# Altium schematic sheet [01] MCU.SchDoc: Raspberry Pi RP2040 MCU
size B; Engineer: M. Folejewski; DocumentNumber: 1; SheetNumber: 1; SheetTotal: 2; PageSize: B; Designators: 1-99
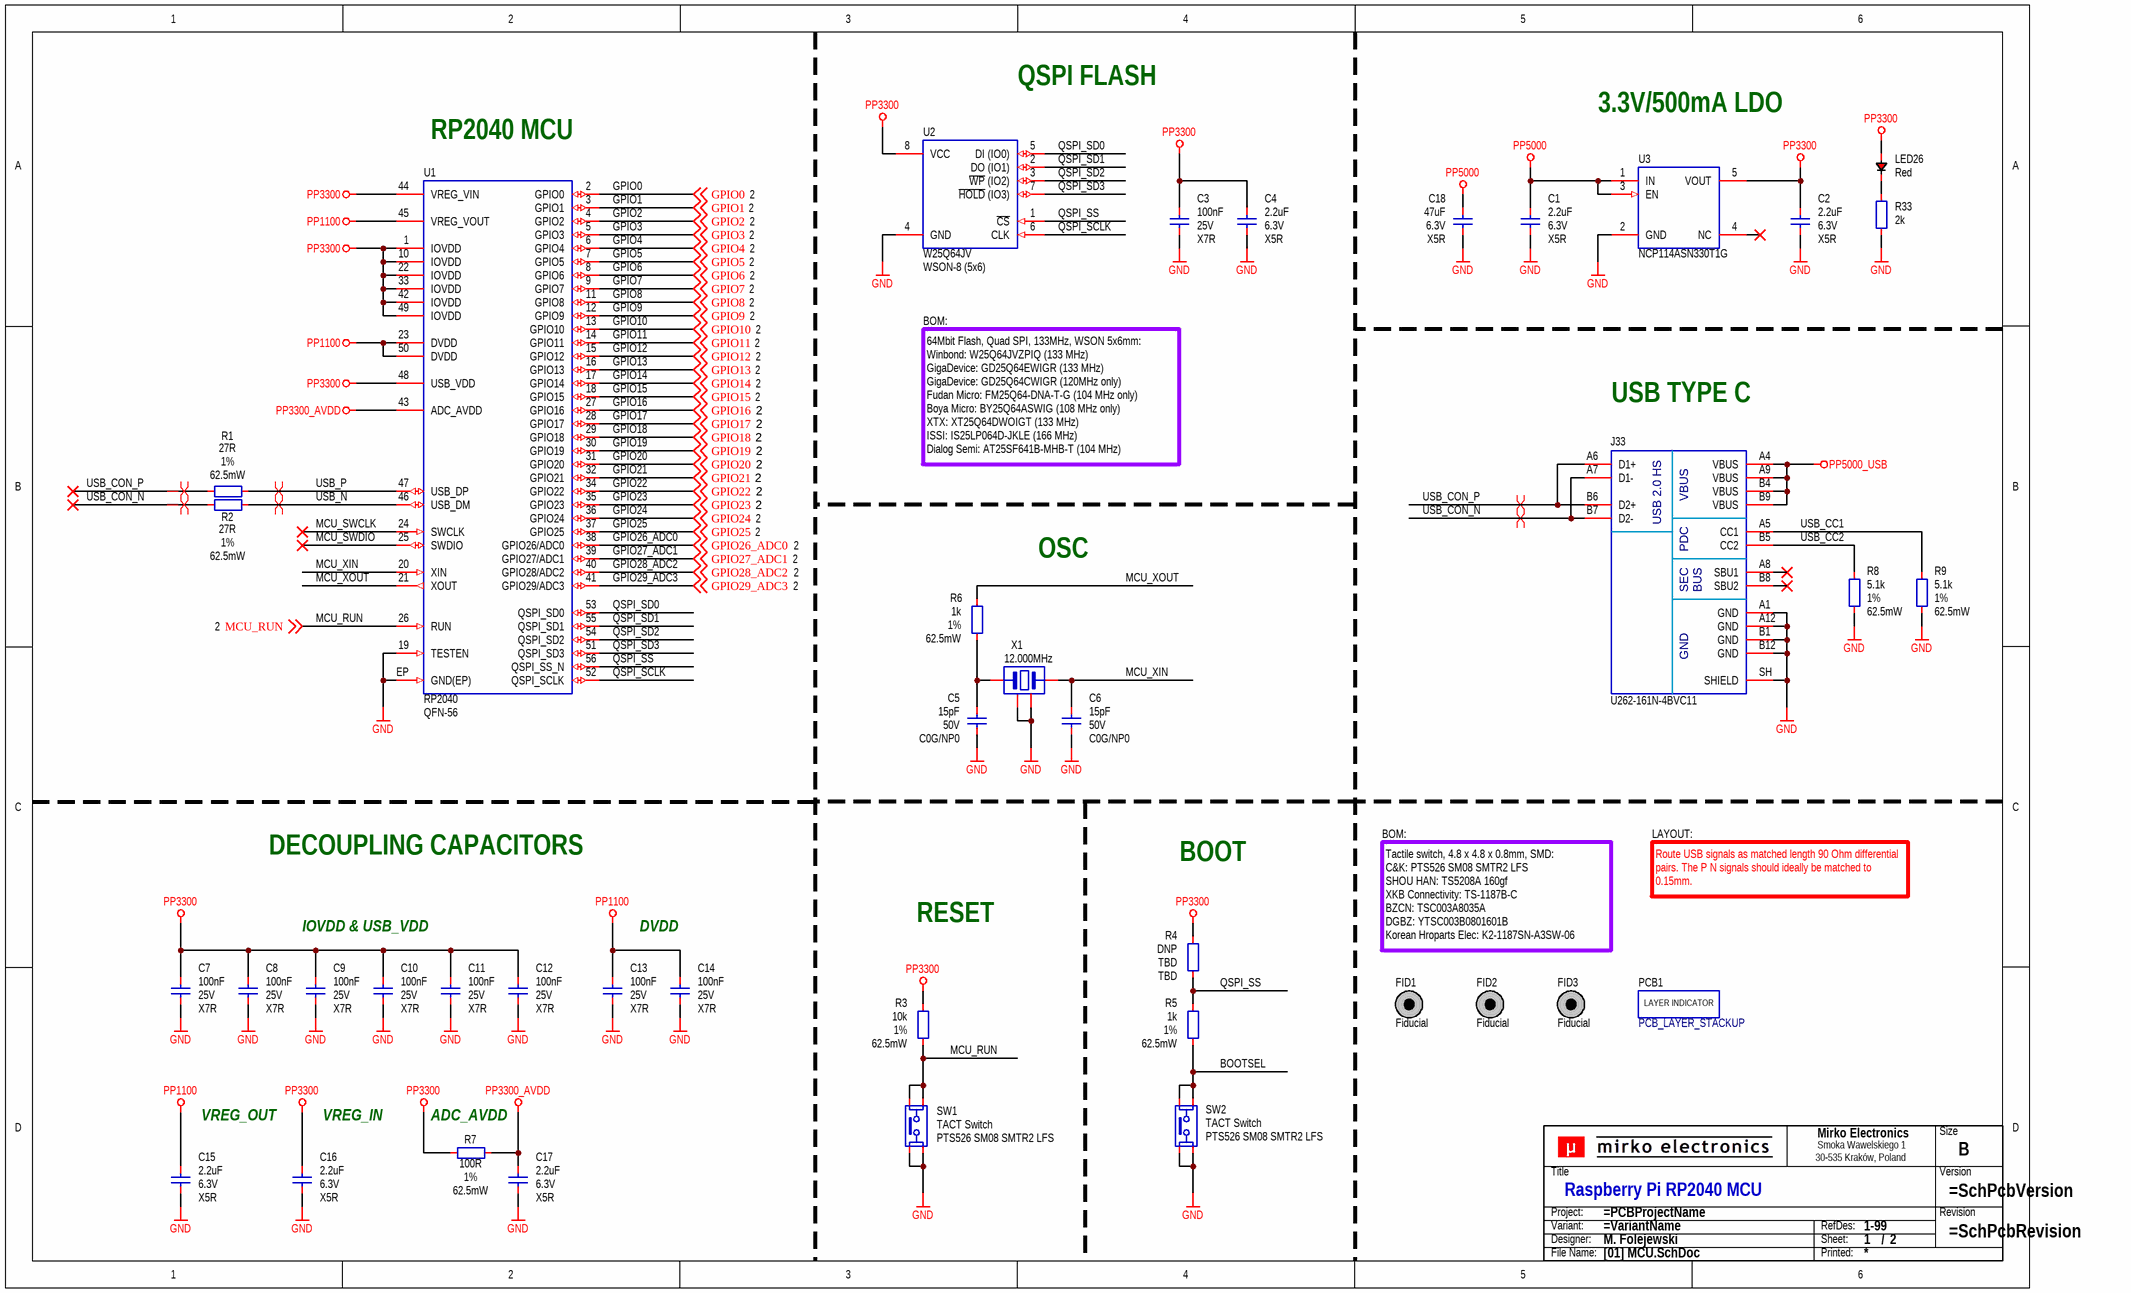
[diagram p0: [01] MCU.SchDoc]

## Parts
C1  2.2uF  Voltage Rating: 6.3V  Dielectric: X5R  [CAP_0402_R]
C2  2.2uF  Voltage Rating: 6.3V  Dielectric: X5R  [CAP_0402_R]
C3  100nF  Voltage Rating: 25V  Dielectric: X7R  [CAP_0402_R]
C4  2.2uF  Voltage Rating: 6.3V  Dielectric: X5R  [CAP_0402_R]
C5  15pF  Voltage Rating: 50V  Dielectric: C0G/NP0  [CAP_0402_R]
C6  15pF  Voltage Rating: 50V  Dielectric: C0G/NP0  [CAP_0402_R]
C7  100nF  Voltage Rating: 25V  Dielectric: X7R  [CAP_0402_R]
C8  100nF  Voltage Rating: 25V  Dielectric: X7R  [CAP_0402_R]
C9  100nF  Voltage Rating: 25V  Dielectric: X7R  [CAP_0402_R]
C10  100nF  Voltage Rating: 25V  Dielectric: X7R  [CAP_0402_R]
C11  100nF  Voltage Rating: 25V  Dielectric: X7R  [CAP_0402_R]
C12  100nF  Voltage Rating: 25V  Dielectric: X7R  [CAP_0402_R]
C13  100nF  Voltage Rating: 25V  Dielectric: X7R  [CAP_0402_R]
C14  100nF  Voltage Rating: 25V  Dielectric: X7R  [CAP_0402_R]
C15  2.2uF  Voltage Rating: 6.3V  Dielectric: X5R  [CAP_0402_R]
C16  2.2uF  Voltage Rating: 6.3V  Dielectric: X5R  [CAP_0402_R]
C17  2.2uF  Voltage Rating: 6.3V  Dielectric: X5R  [CAP_0402_R]
C18  47uF  Voltage Rating: 6.3V  Dielectric: X5R  [CAP_0603_R]
FID1  Fiducial  [PCB_FID_RND_100x300]  (no BOM)
FID2  Fiducial  [PCB_FID_RND_100x300]  (no BOM)
FID3  Fiducial  [PCB_FID_RND_100x300]  (no BOM)
J33  U262-161N-4BVC11  [CON_XKB_U262-161N-4BVC11]
LED26  Red  [LED_0402_R]
PCB1  PCB_LAYER_STACKUP  [PCB_STACKUP-2L_A1]  (no BOM)
R1  27R  Tolerance: 1%  Power Rating: 62.5mW  [RES_0402_R]
R2  27R  Tolerance: 1%  Power Rating: 62.5mW  [RES_0402_R]
R3  10k  Tolerance: 1%  Power Rating: 62.5mW  [RES_0402_R]
R4  DNP  Tolerance: TBD  [RES_0402_R]
R5  1k  Tolerance: 1%  Power Rating: 62.5mW  [RES_0402_R]
R6  1k  Tolerance: 1%  Power Rating: 62.5mW  [RES_0402_R]
R7  100R  Tolerance: 1%  Power Rating: 62.5mW  [RES_0402_R]
R8  5.1k  Tolerance: 1%  Power Rating: 62.5mW  [RES_0402_R]
R9  5.1k  Tolerance: 1%  Power Rating: 62.5mW  [RES_0402_R]
R33  2k  [RES_0402_R]
SW1  TACT Switch  MPN: PTS526 SM08 SMTR2 LFS  [SWI_C&K_PTS526SX08]
SW2  TACT Switch  MPN: PTS526 SM08 SMTR2 LFS  [SWI_C&K_PTS526SX08]
TB?  Title block  (value not drawn)  (graphical)
U1  RP2040  Package (Case): QFN-56  [ICC_QFN56_700X700X90_P40_EP_RP2040]
U2  W25Q64JV  Package: WSON-8 (5x6)  [ICC_WSON8_500X600X80P127_EP]
U3  NCP114ASN330T1G  [ICC_TSOT-5_290X160H110_P95]
X1  12.000MHz  [OSC_3225_4P_R]

## Nets
GND: C1.1 C2.1 C3.1 C4.1 C5.1 C6.1 C7.1 C8.1 C9.1 C10.1 C11.1 C12.1 C13.1 C14.1 C15.1 C16.1 C17.1 C18.1 J33.A1(GND) J33.A12(GND) J33.B1(GND) J33.B12(GND) J33.SH(SHIELD) R8.1 R9.1 R33.1 SW1.3 SW1.4 SW2.3 SW2.4 U1.19(TESTEN) U1.EP(GND(EP)) U2.4(GND) U3.2(GND) X1.2 X1.4
PP1100: C13.2 C14.2 C15.2 U1.23(DVDD) U1.45(VREG_VOUT) U1.50(DVDD)
PP3300: C2.2 C3.2 C4.2 C7.2 C8.2 C9.2 C10.2 C11.2 C12.2 C16.2 LED26.2 R3.2 R4.2 R7.2 U1.1(IOVDD) U1.10(IOVDD) U1.22(IOVDD) U1.33(IOVDD) U1.42(IOVDD) U1.44(VREG_VIN) U1.48(USB_VDD) U1.49(IOVDD) U2.8(VCC) U3.5(VOUT)
PP3300_AVDD: C17.2 R7.1 U1.43(ADC_AVDD)
PP5000: C1.2 C18.2 U3.1(IN) U3.3(EN)
PP5000_USB: J33.A4(VBUS) J33.A9(VBUS) J33.B4(VBUS) J33.B9(VBUS)
BOOTSEL: R5.1 SW2.1 SW2.2
GPIO0: U1.2(GPIO0) ; off-sheet GPIO0
GPIO1: U1.3(GPIO1) ; off-sheet GPIO1
GPIO2: U1.4(GPIO2) ; off-sheet GPIO2
GPIO3: U1.5(GPIO3) ; off-sheet GPIO3
GPIO4: U1.6(GPIO4) ; off-sheet GPIO4
GPIO5: U1.7(GPIO5) ; off-sheet GPIO5
GPIO6: U1.8(GPIO6) ; off-sheet GPIO6
GPIO7: U1.9(GPIO7) ; off-sheet GPIO7
GPIO8: U1.11(GPIO8) ; off-sheet GPIO8
GPIO9: U1.12(GPIO9) ; off-sheet GPIO9
GPIO10: U1.13(GPIO10) ; off-sheet GPIO10
GPIO11: U1.14(GPIO11) ; off-sheet GPIO11
GPIO12: U1.15(GPIO12) ; off-sheet GPIO12
GPIO13: U1.16(GPIO13) ; off-sheet GPIO13
GPIO14: U1.17(GPIO14) ; off-sheet GPIO14
GPIO15: U1.18(GPIO15) ; off-sheet GPIO15
GPIO16: U1.27(GPIO16) ; off-sheet GPIO16
GPIO17: U1.28(GPIO17) ; off-sheet GPIO17
GPIO18: U1.29(GPIO18) ; off-sheet GPIO18
GPIO19: U1.30(GPIO19) ; off-sheet GPIO19
GPIO20: U1.31(GPIO20) ; off-sheet GPIO20
GPIO21: U1.32(GPIO21) ; off-sheet GPIO21
GPIO22: U1.34(GPIO22) ; off-sheet GPIO22
GPIO23: U1.35(GPIO23) ; off-sheet GPIO23
GPIO24: U1.36(GPIO24) ; off-sheet GPIO24
GPIO25: U1.37(GPIO25) ; off-sheet GPIO25
GPIO26_ADC0: U1.38(GPIO26/ADC0) ; off-sheet GPIO26_ADC0
GPIO27_ADC1: U1.39(GPIO27/ADC1) ; off-sheet GPIO27_ADC1
GPIO28_ADC2: U1.40(GPIO28/ADC2) ; off-sheet GPIO28_ADC2
GPIO29_ADC3: U1.41(GPIO29/ADC3) ; off-sheet GPIO29_ADC3
MCU_RUN: R3.1 SW1.1 SW1.2 U1.26(RUN) ; off-sheet MCU_RUN
MCU_SWCLK: U1.24(SWCLK)
MCU_SWDIO: U1.25(SWDIO)
MCU_XIN: C6.2 U1.20(XIN) X1.3
MCU_XOUT: R6.1 U1.21(XOUT)
QSPI_SCLK: U1.52(QSPI_SCLK) U2.6(CLK)
QSPI_SD0: U1.53(QSPI_SD0) U2.5(DI_(IO0))
QSPI_SD1: U1.55(QSPI_SD1) U2.2(DO_(IO1))
QSPI_SD2: U1.54(QSPI_SD2) U2.3(~{WP}_(IO2))
QSPI_SD3: U1.51(QSPI_SD3) U2.7(~{HOLD}_(IO3))
QSPI_SS: R4.1 R5.2 U1.56(QSPI_SS_N) U2.1(~{CS})
USB_CC1: J33.A5(CC1) R9.2
USB_CC2: J33.B5(CC2) R8.2
USB_CON_N: J33.A7(D1-) J33.B7(D2-) R2.1
USB_CON_P: J33.A6(D1+) J33.B6(D2+) R1.1
USB_N: R2.2 U1.46(USB_DM)
USB_P: R1.2 U1.47(USB_DP)
NetC5_2: C5.2 R6.2 X1.1
NetLED26_1: LED26.1 R33.2

Not connected (* = marked no-connect by the designer): J33 A8(SBU1)* B8(SBU2)*; U3 4(NC)*

## Layout directives
differential pair: USB_CON_N, USB_CON_P, USB_N, USB_P

## Notes on the sheet
- QSPI FLASH
- (near U1) RP2040 MCU
- 3.3V/500mA LDO
- BOM:
- USB TYPE C
- 64Mbit Flash, Quad SPI, 133MHz, WSON 5x6mm:
  Winbond: W25Q64JVZPIQ (133 MHz)
  GigaDevice: GD25Q64EWIGR (133 MHz)
  GigaDevice: GD25Q64CWIGR (120MHz only)
  Fudan Micro: FM25Q64-DNA-T-G (104 MHz only)
  Boya Micro: BY25Q64ASWIG (108 MHz only)
  XTX: XT25Q64DWOIGT (133 MHz)
  ISSI: IS25LP064D-JKLE (166 MHz)
  Dialog Semi: AT25SF641B-MHB-T (104 MHz)
- OSC
- LAYOUT:
- DECOUPLING CAPACITORS
- BOOT
- Route USB signals as matched length 90 Ohm differential pairs. The P N signals should ideally be matched to 0.15mm.
- IOVDD & USB_VDD
- DVDD
- RESET
- Tactile switch, 4.8 x 4.8 x 0.8mm, SMD:
  C&K: PTS526 SM08 SMTR2 LFS
  SHOU HAN: TS5208A 160gf
  XKB Connectivity: TS-1187B-C
  BZCN: TSC003A8035A
  DGBZ: YTSC003B0801601B
  Korean Hroparts Elec: K2-1187SN-A3SW-06
- VREG_OUT
- VREG_IN
- (near R7) ADC_AVDD
- (in symbol CON_USB_TYPE_C_16P) USB 2.0 HS; PDC; SEC; BUS
- (in symbol PCB_LAYER_STACKUP) LAYER INDICATOR
- (in symbol SCH_TITLE_BLOCK_V1) Mirko Electronics; Size; Smoka Wawelskiego 1; 30-535 Kraków, Poland; Title; Version; Project:; Revision; Variant:; RefDes:; Designer:; Sheet:; /; File Name:; Printed:

## Library data of the parts
C1 C2 C4 C15-C17 = CAP-0026: Capacitor; MLCC; GENERIC; TBD; TBD; TBD; TBD; SMD; 0402 (1005);; Manufacturer: Samsung Electro-Mechanics; MPN: CL05A225MQ5NNNC; Component Body: 1.00 x 0.50mm; ID: CAP-0026; Component Type: Capacitor; Component Subtype: MLCC; Value: 2.2uF; Mounting Type: SMD; Package (Case): 0402 (1005); Component Height: TBD; Packaging Type: TBD; ROHS Status: TBD; Operating Temperature: TBD; Capacitance: 2.2uF; Tolerance: TBD; Features: TBD; Supplier 1: LCSC; Supplier 2: Farnell; Supplier Part Number 1: C107371; Supplier Part Number 2: 3013335; Supplier 3: Mouser; Supplier Part Number 3: 187-CL05A225MQ5NNNC
C3 C7-C14 = CAP-0026: Capacitor; MLCC; GENERIC; TBD; TBD; TBD; TBD; SMD; 0402 (1005);; Manufacturer: Samsung Electro-Mechanics; MPN: CL05B104KA5NNNC; Component Body: 1.00 x 0.50mm; ID: CAP-0026; Component Type: Capacitor; Component Subtype: MLCC; Value: 100nF; Mounting Type: SMD; Package (Case): 0402 (1005); Component Height: TBD; Packaging Type: TBD; ROHS Status: TBD; Operating Temperature: TBD; Capacitance: 100nF; Tolerance: TBD; Features: TBD; Supplier 1: LCSC; Supplier 2: Farnell; Supplier Part Number 1: C155422; Supplier Part Number 2: 2496772; Supplier 3: Mouser; Supplier Part Number 3: 187-CL05B104KA5NNNC
C5 C6 = CAP-0026: Capacitor; MLCC; GENERIC; TBD; TBD; TBD; TBD; SMD; 0402 (1005);; Manufacturer: KEMET Corporation; MPN: C0402C150J5GACTU; Component Body: 1.00 x 0.50mm; ID: CAP-0026; Component Type: Capacitor; Component Subtype: MLCC; Value: 15pF; Mounting Type: SMD; Package (Case): 0402 (1005); Component Height: TBD; Packaging Type: TBD; ROHS Status: TBD; Operating Temperature: TBD; Capacitance: 15pF; Tolerance: TBD; Features: TBD; Supplier 1: LCSC; Supplier 2: Farnell; Supplier Part Number 1: C106997; Supplier Part Number 2: 1414577; Supplier 3: Mouser; Supplier Part Number 3: 80-C0402C150J5G
C18 = CAP-0023: Capacitor; MLCC; GENERIC; TBD; TBD; TBD; TBD; SMD; 0603 (1608);; Manufacturer: Murata Electronics; ID: CAP-0023; Component Type: Capacitor; Component Subtype: MLCC; Value: 47uF; MPN: GENERIC; Mounting Type: SMD; Package (Case): 0603 (1608); Component Body: TBD; Component Height: TBD; Packaging Type: TBD; ROHS Status: TBD; Operating Temperature: TBD; Capacitance: 47uF; Tolerance: TBD; Features: TBD; Supplier 1: LCSC; Supplier 2: Farnell; Supplier 3: Mouser; Supplier Part Number 1: C140782; Supplier Part Number 2: 3582851; Supplier Part Number 3: 81-GRM188R60J476ME5J
FID1-FID3 = PCB_FID_RND: PCB Marking; Fiducial; Round;; Value: Fiducial; Component Subtype: -; Component Type: Fiducial; Mounting Type: -; Supplier: ?
J33 = CON_USB_TYPE_C_16P: Connector; USB 3.1 Type C; Receptacle; 24-pin; USB 2.0 Only;; Manufacturer: XKB Connectivity; Component Subtype: USB-C; Package (Case): SMD; Value: U262-161N-4BVC11; MPN: U262-161N-4BVC11; Component Type: Connector; Mounting Type: SMD; Supplier: ?
LED26 = DIO_LED_RED: Diode; LED; Red;; Component Subtype: LED Diode; Package (Case): 0402 (1005); Value: Red; Component Type: LED; Mounting Type: SMD; Supplier 1: LCSC; Supplier 2: Farnell; Supplier Part Number 1: C965790; Supplier Part Number 2: 2900754; Supplier 3: Mouser; Supplier Part Number 3: 710-150040RS73240
R1 R2 = RES-0058: Resistor; Thick Film; GENERIC; TBD; TBD; TBD; TBD; TBD; SMD; 0402 (1005);; Manufacturer: Yageo Corporation; MPN: RC0402FR-0727RL; Component Body: 1.00 x 0.50mm; Voltage Rating: 50V; ID: RES-0058; Component Type: Resistor; Component Subtype: Thick Film; Value: 27R; Mounting Type: SMD; Package (Case): 0402 (1005); Component Height: TBD; Packaging Type: TBD; ROHS Status: TBD; Operating Temperature: TBD; Resistance: 27R; TCR: TBD; Features: TBD; Supplier 1: LCSC; Supplier 2: Farnell; Supplier Part Number 1: C138021; Supplier Part Number 2: 9239049; Supplier 3: Mouser; Supplier Part Number 3: 603-RC0402FR-0727RL
R3 = RES-0004: Resistor; Thick Film; 10k; 1%; 62.5mW; 100PPM; 50V; Standard; SMD; 0402 (1005);; Manufacturer: Yageo Corporation; MPN: RC0402FR-0710KL; Component Body: 1.00 x 0.50mm; Packaging Type: Tape & Reel; ID: RES-0004; Component Type: Resistor; Component Subtype: Thick Film; Value: 10k; Mounting Type: SMD; Package (Case): 0402 (1005); Component Height: 0.35mm; ROHS Status: RoHS Compliant; Operating Temperature: -55°C to +155°C; Resistance: 10k; TCR: 100PPM; Voltage Rating: 50V; Features: Standard; Supplier 1: LCSC; Supplier 2: Farnell; Supplier Part Number 1: C60490; Supplier Part Number 2: 9239359; Supplier 3: Mouser; Supplier Part Number 3: 603-RC0402FR-0710KL
R4 = RES-0058: Resistor; Thick Film; GENERIC; TBD; TBD; TBD; TBD; TBD; SMD; 0402 (1005);; Component Body: 1.00 x 0.50mm; ID: RES-0058; Power Rating: TBD; Component Type: Resistor; Component Subtype: Thick Film; Value: DNP; Manufacturer: GENERIC; MPN: GENERIC; Mounting Type: SMD; Package (Case): 0402 (1005); Component Height: TBD; Packaging Type: TBD; ROHS Status: TBD; Operating Temperature: TBD; Resistance: GENERIC; TCR: TBD; Voltage Rating: TBD; Features: TBD; Supplier 1: LCSC; Supplier 2: Farnell; Supplier Part Number 1: -; Supplier Part Number 2: -; Supplier 3: Mouser; Supplier Part Number 3: -
R5 R6 = RES-0003: Resistor; Thick Film; 1k; 1%; 62.5mW; 100PPM; 50V; Standard; SMD; 0402 (1005);; Manufacturer: Yageo Corporation; MPN: RC0402FR-071KL; Component Body: 1.00 x 0.50mm; Packaging Type: Tape & Reel; ID: RES-0003; Component Type: Resistor; Component Subtype: Thick Film; Value: 1k; Mounting Type: SMD; Package (Case): 0402 (1005); Component Height: 0.35mm; ROHS Status: RoHS Compliant; Operating Temperature: -55°C to +155°C; Resistance: 1k; TCR: 100PPM; Voltage Rating: 50V; Features: Standard; Supplier 1: LCSC; Supplier 2: Farnell; Supplier Part Number 1: C106235; Supplier Part Number 2: 9239235; Supplier 3: Mouser; Supplier Part Number 3: 603-RC0402FR-071KL
R7 = RES-0002: Resistor; Thick Film; 100R; 1%; 62.5mW; 100PPM; 50V; Standard; SMD; 0402 (1005);; Manufacturer: Yageo Corporation; MPN: RC0402FR-07100RL; Component Body: 1.00 x 0.50mm; Packaging Type: Tape & Reel; ID: RES-0002; Component Type: Resistor; Component Subtype: Thick Film; Value: 100R; Mounting Type: SMD; Package (Case): 0402 (1005); Component Height: 0.35mm; ROHS Status: RoHS Compliant; Operating Temperature: -55°C to +155°C; Resistance: 100R; TCR: 100PPM; Voltage Rating: 50V; Features: Standard; Supplier 1: LCSC; Supplier 2: Farnell; Supplier Part Number 1: C106232; Supplier Part Number 2: 2421888; Supplier 3: Mouser; Supplier Part Number 3: 603-RC0402FR-07100RL
R8 R9 = RES-0058: Resistor; Thick Film; GENERIC; TBD; TBD; TBD; TBD; TBD; SMD; 0402 (1005);; Manufacturer: Yageo Corporation; MPN: RC0402FR-075K1L; Component Body: 1.00 x 0.50mm; ID: RES-0058; Component Type: Resistor; Component Subtype: Thick Film; Value: 5.1k; Mounting Type: SMD; Package (Case): 0402 (1005); Component Height: TBD; Packaging Type: TBD; ROHS Status: TBD; Operating Temperature: TBD; Resistance: 5.1k; TCR: TBD; Voltage Rating: TBD; Features: TBD; Supplier 1: LCSC; Supplier 2: Farnell; Supplier 3: Mouser; Supplier Part Number 1: C105872; Supplier Part Number 2: 1458805; Supplier Part Number 3: 603-RC0402FR-075K1L
R33 = RES-0058: Resistor; Thick Film; GENERIC; TBD; TBD; TBD; TBD; TBD; SMD; 0402 (1005);; Manufacturer: Yageo Corporation; MPN: RC0402FR-072KP; Component Body: 1.00 x 0.50mm; Tolerance: 1%; Power Rating: 62.5mW; Voltage Rating: 50V; ID: RES-0058; Component Type: Resistor; Component Subtype: Thick Film; Value: 2k; Mounting Type: SMD; Package (Case): 0402 (1005); Component Height: TBD; Packaging Type: TBD; ROHS Status: TBD; Operating Temperature: TBD; Resistance: 2k; TCR: TBD; Features: TBD; Supplier 1: LCSC; Supplier 2: Farnell; Supplier Part Number 1: C60488; Supplier Part Number 2: 1458757; Supplier 3: Mouser; Supplier Part Number 3: 603-RC0402FR-072KL
SW1 SW2 = SWI_TACT_4P_AABB: Switch; Tactile; Monostable;; Manufacturer: C&K Switches; Package (Case): 3780595; Value: TACT Switch; Component Subtype: TACT Switch; Component Type: Switch; Mounting Type: SMD; Supplier 1: LCSC; Supplier 2: Farnell; Supplier Part Number 1: C2681473; Supplier Part Number 2: 3780595; Supplier 3: Mouser; Supplier Part Number 3: 611-PTS526SM08SMTR2L
TB? = SCH_TITLE_BLOCK_V1: Component Type: Title block; Manufacturer: -; Mounting Type: Non component; MPN: -; Operating Temperature: -; Package: -; Specification: Title block; Value: Title block; Replacement: -; System: ?
U1 = ICC_RPI_RP2040_QFN56: IC; MCU;; Manufacturer: Raspberry Pi; Component Subtype: MCU; Component Type: IC; Mounting Type: SMD; MPN: RP2040; Value: RP2040; Supplier 1: LCSC; Supplier Part Number 1: C2040; Supplier 2: Farnell; Supplier Part Number 2: 3766082; Supplier 3: Mouser; Supplier Part Number 3: 358-RP2040CHIP-7-500
U2 = ICC_WBD_W25Q64_SOIC_WSON: ICC; Manufacturer: Winbond Electronics; MPN: W25Q64JVZPIQ; Specification: Serial Flash memory, 64Mbit, standard-, dual-, Quad- SPI interface, 133MHz, WSON 5x6mm package; Component Type: IC; Mounting Type: SMD; Operating Temperature: -40°C to +85°C; Value: W25Q64JV; Supplier 1: LCSC; Supplier 2: Farnell; Supplier Part Number 1: C2940197; Supplier Part Number 2: 3129183; Supplier 3: Mouser; Supplier Part Number 3: 454-W25Q64JVZPIQ
U3 = ICC_ONS_NCP114_TSOP5: ICC; LDO;; MPN: NCP114ASN330T1G; Supplier 1: LCSC; Supplier 2: Farnell; Supplier 3: Mouser; Supplier Part Number 1: C457666; Supplier Part Number 2: 2677151; Supplier Part Number 3: 863-NCP114ASN330T1G; Value: NCP114ASN330T1G
X1 = OSC_XTL_P4: Oscillator; Crystal;; Manufacturer: ABRACON; MPN: ABM8G-106-12.000MHZ-T; Value: 12.000MHz; Component Subtype: Crystal; Component Type: Crystal; Mounting Type: SMD; Package (Case): SMD 3225; Supplier 1: LCSC; Supplier 2: Farnell; Supplier Part Number 1: C9002; Supplier Part Number 2: 2889293; Supplier 3: Mouser; Supplier Part Number 3: 815-ABM8G-106-12-T
PCB1 = PCB_LAYER_STACKUP: Component Subtype: -; Component Type: PCB Marking; Mounting Type: -; Supplier: ?